# EAGLE design Matchstick (EAGLE 9.6.2)

## Sheet 1 of 2: ESP32 Pico
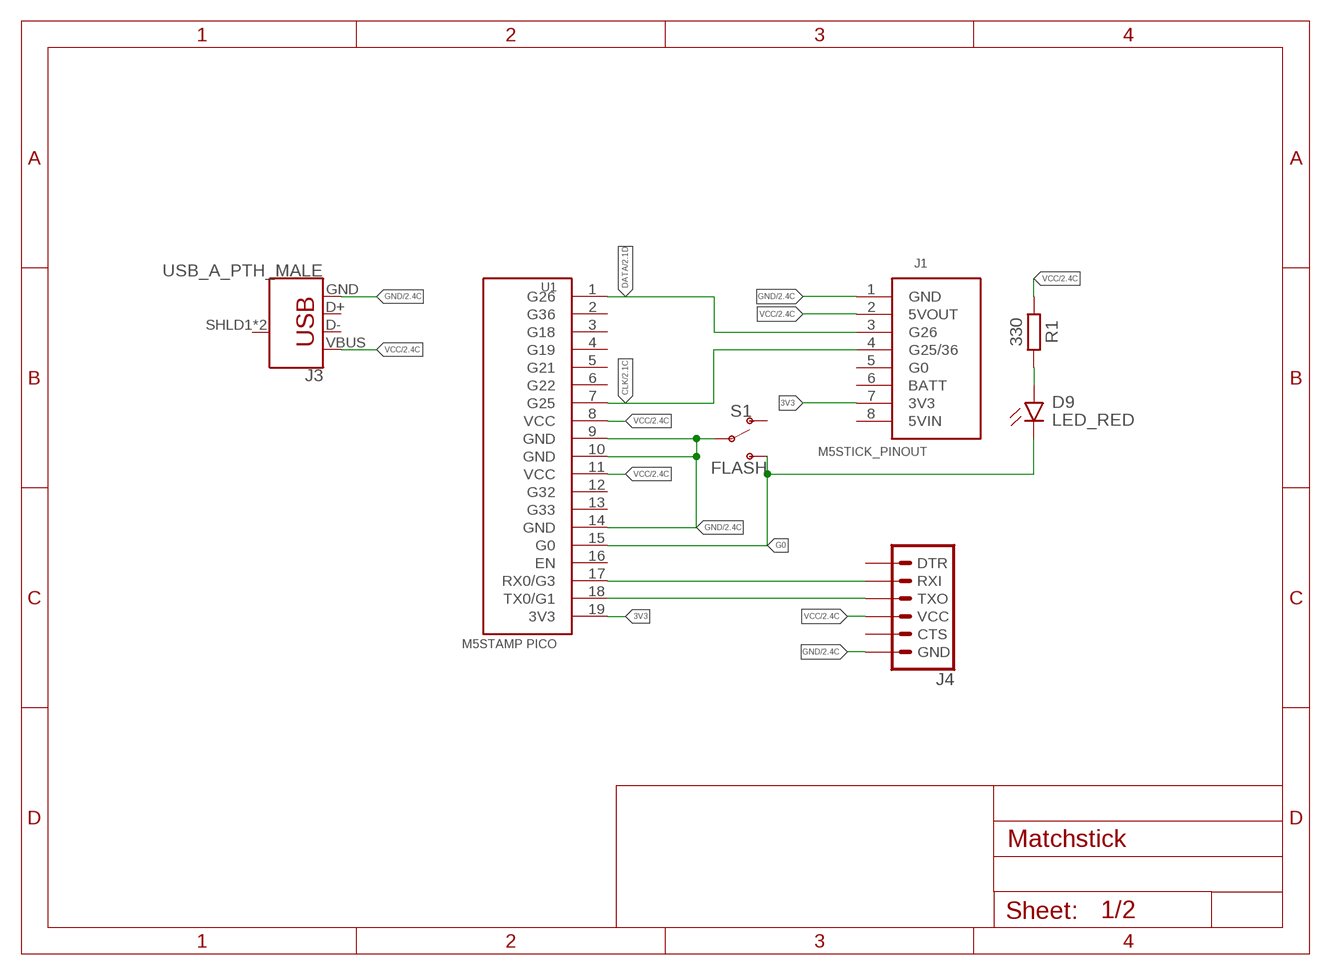
[diagram p0: schematic, sheet 1]

### Parts
D9  LED_RED  CHIP-ROUND-R_0805  [LEDC2012X105N_RND-R]
J1  M5STICK_PINOUT  [M5STICK_PINOUT]
J3  USB_A_PTH_MALE  [USB-A-H]
J4  6_PIN_SERIAL_TARGETSILK  [6_PIN_SERIAL_TARGET_SIDE_W_SILK]
R1  330  R_CHIP-0805(2012-METRIC)  [RESC2012X65]
S1  FLASH  SWITCH-SPDT-SMD-RIGHT-ANGLE  [SWITCH_SPST_SMD_A]
U1  M5STAMP PICO  M5STAMP-PICO  [M5STAMP-PICO]

### Nets
3V3: J1.7(3V3) U1.19(3V3)
CLK: J1.4(G25/36) U1.7(G25) ; also sheet 2
DATA: J1.3(G26) U1.1(G26) ; also sheet 2
G0: D9.C S1.3(S) U1.15(G0)
GND: J1.1(GND) J3.GND J4.P$6(GND) S1.2(P) U1.9(GND) U1.10(GND) U1.14(GND) ; also sheet 2
LED_PWR: D9.A R1.2
RX: J4.P$3(RXI) U1.17(RX0/G3)
TX: J4.P$2(TXO) U1.18(TX0/G1)
VCC: J1.2(5VOUT) J3.VBUS J4.P$4(VCC) R1.1 U1.8(VCC) U1.11(VCC) ; also sheet 2
Unconnected: J1.5(G0) J1.6(BATT) J1.8(5VIN) J3.D+ J3.D- J3.SHLD1(SHIELD) J3.SHLD2(SHIELD) J4.P$1(DTR) J4.P$5(CTS) S1.1(O) U1.2(G36) U1.3(G18) U1.4(G19) U1.5(G21) U1.6(G22) U1.12(G32) U1.13(G33) U1.16(EN)

## Sheet 2 of 2: LED Array
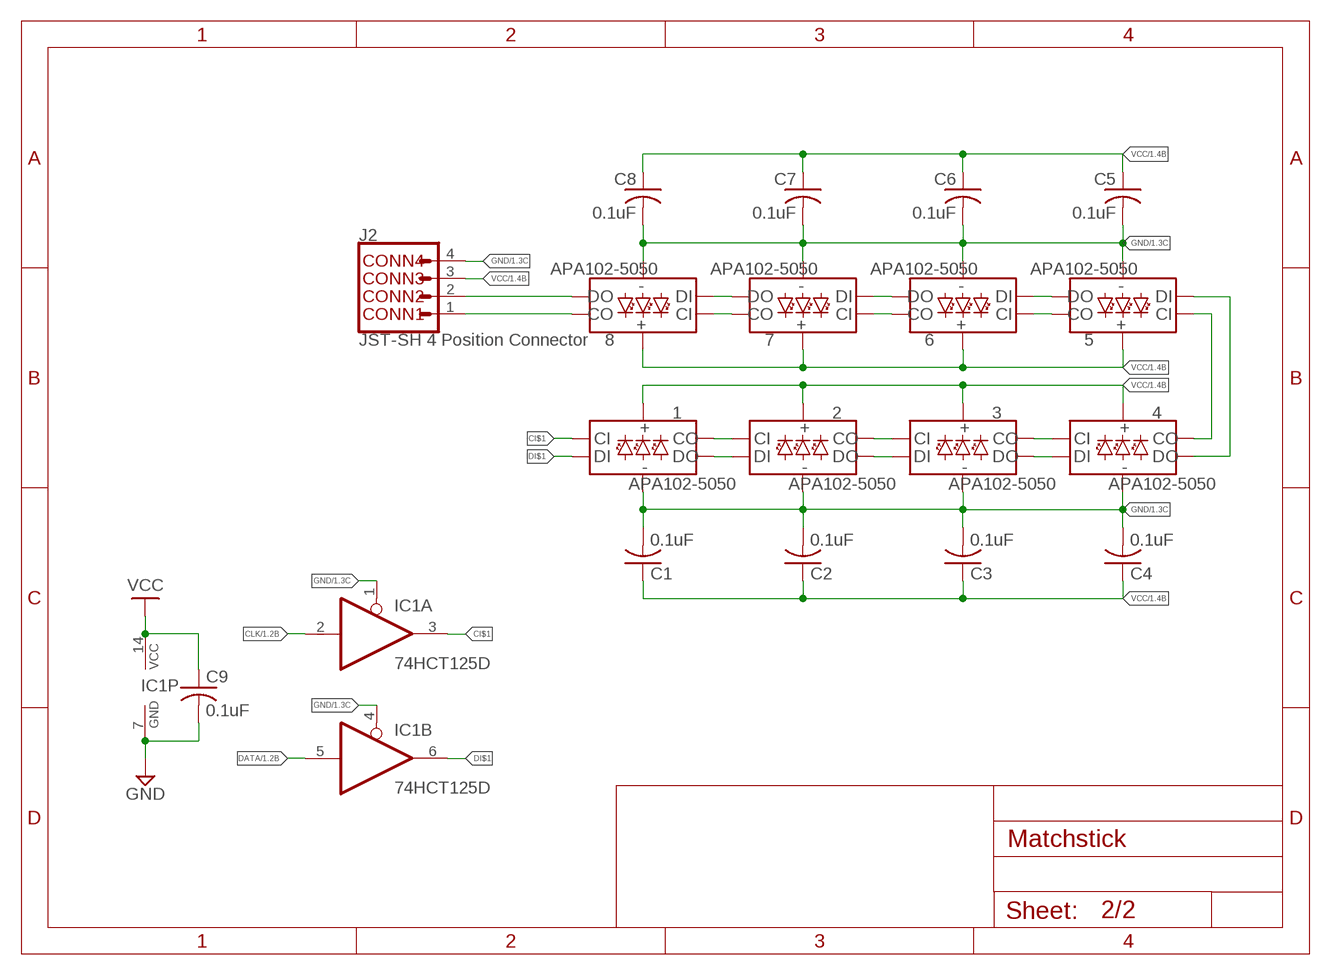
[diagram p1: schematic, sheet 2]

### Parts
1  APA102-5050  [APA102-5050]
2  APA102-5050  [APA102-5050]
3  APA102-5050  [APA102-5050]
4  APA102-5050  [APA102-5050]
5  APA102-5050  [APA102-5050]
6  APA102-5050  [APA102-5050]
7  APA102-5050  [APA102-5050]
8  APA102-5050  [APA102-5050]
C1  0.1uF  C-US_CHIP-0805(2012-METRIC)  [CAPC2012X110]
C2  0.1uF  C-US_CHIP-0805(2012-METRIC)  [CAPC2012X110]
C3  0.1uF  C-US_CHIP-0805(2012-METRIC)  [CAPC2012X110]
C4  0.1uF  C-US_CHIP-0805(2012-METRIC)  [CAPC2012X110]
C5  0.1uF  C-US_CHIP-0805(2012-METRIC)  [CAPC2012X110]
C6  0.1uF  C-US_CHIP-0805(2012-METRIC)  [CAPC2012X110]
C7  0.1uF  C-US_CHIP-0805(2012-METRIC)  [CAPC2012X110]
C8  0.1uF  C-US_CHIP-0805(2012-METRIC)  [CAPC2012X110]
C9  0.1uF  C-US_CHIP-0805(2012-METRIC)  [CAPC2012X110]
IC1  74HCT125D  [SO14]
J2  JST-SH 4 Position Connector  JST-4-SHJS-1MM  [JST04_1MM_RA]

### Nets
CI$1: 1.P2(CI) IC1.3(A:O)
CI$2: 1.P5(CO) 2.P2(CI)
CI$3: 2.P5(CO) 3.P2(CI)
CI$4: 3.P5(CO) 4.P2(CI)
CI$5: 4.P5(CO) 5.P2(CI)
CI$6: 5.P5(CO) 6.P2(CI)
CI$7: 6.P5(CO) 7.P2(CI)
CI$8: 7.P5(CO) 8.P2(CI)
CLK: IC1.2(A:I) ; also sheet 1
CO: 8.P5(CO) J2.1
DATA: IC1.5(B:I) ; also sheet 1
DI$1: 1.P1(DI) IC1.6(B:O)
DI$2: 1.P6(DO) 2.P1(DI)
DI$3: 2.P6(DO) 3.P1(DI)
DI$4: 3.P6(DO) 4.P1(DI)
DI$5: 4.P6(DO) 5.P1(DI)
DI$6: 5.P6(DO) 6.P1(DI)
DI$7: 6.P6(DO) 7.P1(DI)
DI$8: 7.P6(DO) 8.P1(DI)
DO: 8.P6(DO) J2.2
GND: 1.P3(GND) 2.P3(GND) 3.P3(GND) 4.P3(GND) 5.P3(GND) 6.P3(GND) 7.P3(GND) 8.P3(GND) C1.2 C2.2 C3.2 C4.2 C5.2 C6.2 C7.2 C8.2 C9.2 IC1.1(A:OE) IC1.4(B:OE) IC1.7(P:GND) J2.4 ; also sheet 1
VCC: 1.P4(VCC) 2.P4(VCC) 3.P4(VCC) 4.P4(VCC) 5.P4(VCC) 6.P4(VCC) 7.P4(VCC) 8.P4(VCC) C1.1 C2.1 C3.1 C4.1 C5.1 C6.1 C7.1 C8.1 C9.1 IC1.14(P:VCC) J2.3 ; also sheet 1
Unconnected: IC1.8(C:O) IC1.9(C:I) IC1.10(C:OE) IC1.11(D:O) IC1.12(D:I) IC1.13(D:OE)

## Library data of the parts
1-8 = SparkFun-LED:APA102: Addressable RGB LED - 2 Wire Common names: APA102, Dotstar, etc. Packages: 5050 2020 SparkFun Products: SparkFun Lumenati Boards <https://www.sparkfun.com/categories/405>; PROD_ID: DIO-13739
C1-C9 = Capacitor:C-US: Capacitor - ANSI; CATEGORY: Capacitor
D9 = LED:CHIP-ROUND-R: LED - Generic; CATEGORY: LED; COLOR: RED; DESCRIPTION: CHIP LED ROUND; SUB-CATEGORY: CHIP; TYPE: ROUND_TOP
IC1 = 74xx-eu:74*125: Quad bus BUFFER, 3-state
J1 = custom:M5STICK_PINOUT: M5 STICK C HEADER 8POS 2.54MM
J2 = custom:JST-4-SH: JST-SH 4 position connector An SMD 1mm pitch JST-SH connector. Compatible with SparkFun Qwiic connectors.; PROD_ID: CONN-13694
J3 = SparkFun-Connectors:USB_A: USB-A Connector Male and female variants, as well as PTH and SMT variants SparkFun Products: SparkFun XBee Explorer Dongle <https://www.sparkfun.com/products/11697> PTH Male SparkFun MicroView-USB Programmer <https://www.sparkfun.com/products/12924> SMT Male SparkFun USB Type A Female Breakout <https://www.sparkfun.com/products/12700> SMT Female; PROD_ID: CONN-08367; SF_ID: PRT-00437
J4 = SparkFun-Connectors:6_PIN_SERIAL_TARGET: 6-pin header connection for use with the "FTDI BASIC" pinout - TARGET SIDE. Also known as "Arduino Serial Program Header". It is used to mate with our FTDI Basic serial programmers using the Arduino IDE. Note, this device has "TARGET" in the name. It is intended to be used on a design that contains a target micro-controller that you wish to program. The "sister" device, named "CABLE" is inteneded to be used on a design that usually lives on the end of your USB cable and prvides the converter chip (FTDI232 or FTDI231x) to commnicate serial RX/TX. You can populate with some of these: Break Away Headers - Straight <https://www.sparkfun.com/products/116> (PRT-00116) For reference (or to suit your programming needs) check out these designs: SparkFun FTDI Basic Breakout - 5V <https://www.sparkfun.com/products/9716> (DEV-09716) SparkFun FTDI Basic Breakout - 3.3V <https://www.sparkfun.com/products/9873> (DEV-09873) SparkFun FTDI SmartBasic <https://www.sparkfun.com/products/12935> (DEV-12935) SparkFun Beefy 3 - FTDI Basic Breakout <https://www.sparkfun.com/products/13746> (DEV-13746)
R1 = Resistor:R: Resistor Fixed - Generic; CATEGORY: Resistor; SUB-CATEGORY: Fixed
S1 = SparkFun-Switches:SWITCH-SPDT: Single Pole, Double Throw (SPDT) Switch Single-pole, double-throw (SPDT) switch. Variant Overview SMD-AYZ0202 Surface Mount DPDT Switch <https://www.sparkfun.com/products/597> (COM-00597) Used on e.g. LilyPad Arduino USB - ATmega32U4 Board <https://www.sparkfun.com/products/12049> PTH-11.6X4.0MM SPDT Mini Power Switch <https://www.sparkfun.com/products/102> (COM-00102) Used on e.g. SparkFun Simon Says - Through-Hole Soldering Kit <https://www.sparkfun.com/products/10547> (KIT-10547) PTH-11.6X4.0MM-KIT KIT version of SPDT Mini Power Switch - Simplifies soldering by removing tStop of switch pins - only one side can be soldered. PTH-11.6X4.0MM-LOCK LOCK version of SPDT Mini Power Switch - Offset pins hold switch in place for easier soldering. SMD-RIGHT-ANGLE Surface Mount Right Angle Switch <https://www.sparkfun.com/products/10860> (COM-10860) Used on e.g. SparkFun ESP8266 Thing <https://www.sparkfun.com/products/13231>; PROD_ID: SWCH-10651; SF_SKU: COM-10860
U1 = custom:M5STAMP-PICO: M5 Stamp Pico <https://docs.m5stack.com/en/core/stamp_pico>

## Board
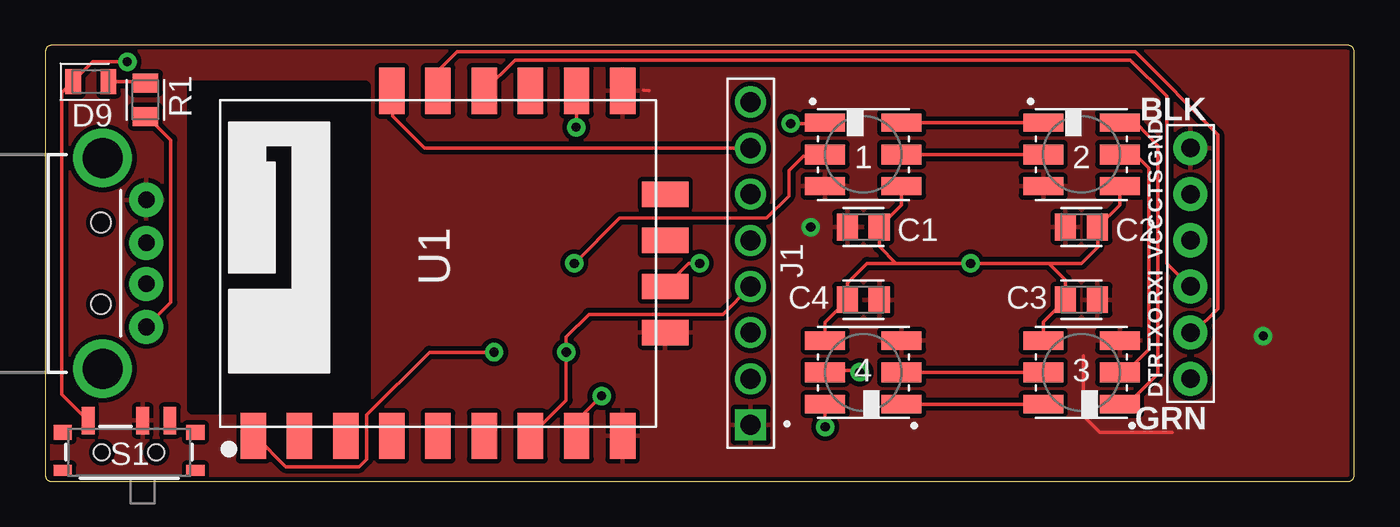
[diagram p2: board, top side]
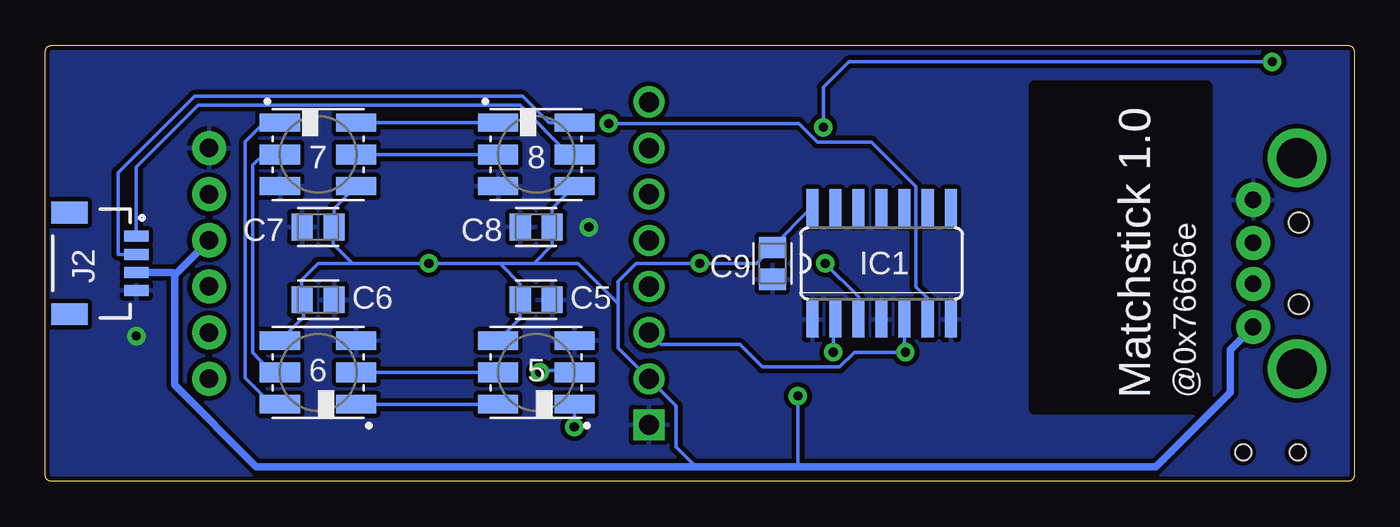
[diagram p3: board, bottom side, seen from below]

Size 72 x 24 mm. Coordinates in mm from the lower left corner, seen from the top.
Outline: 0.32,0 71.68,0 arc90 72,0.32 72,23.68 arc90 71.68,24 0.32,24 arc90 0,23.68 0,0.32 arc90 0.32,0
Copper layers (1*16): Top 0.035mm / dielectric 1.5mm / Bottom 0.035mm
Design rules "SparkFun *": minimum track width 8mil, minimum drill 20mil, track to track 8mil, track to pad 8mil, pad to pad 8mil, via to via 8mil, smd to smd 8mil, copper to edge 10mil, drill to drill 8mil, minimum pad ring 12mil, minimum via ring 10mil, stop-mask expansion 4mil, vias tented up to drill 20mil, thermal gap 10mil
bRestrict: area 25.3,7.5 to 28,7.7

### Footprints (pad centres in the part's own frame; a part is rotated, then mirrored left to right if it is on the bottom)
APA102-5050 = smd 1 x 2.2: P1 -1.75,-2.1; P3 1.75,-2.1; P4 1.75,2.1; P6 -1.75,2.1 | smd 1.1 x 2.2: P2 0,-2.1; P5 0,2.1
CAPC2012X110 = smd 1.165 x 1.465: 1 -0.875,0; 2 0.875,0
LEDC2012X105N_RND-R = smd 0.862 x 1.362: A 0.975,0; C -0.975,0
SO14 = smd 0.66 x 2.032: 1 -3.81,-3.073; 2 -2.54,-3.073; 3 -1.27,-3.073; 4 0,-3.073; 5 1.27,-3.073; 6 2.54,-3.073; 7 3.81,-3.073; 8 3.81,3.073; 9 2.54,3.073; 10 1.27,3.073; 11 0,3.073; 12 -1.27,3.073; 13 -2.54,3.073; 14 -3.81,3.073
M5STICK_PINOUT = drill 1.1 square: 1 -8.89,0 | drill 1.1: 2 -6.35,0; 3 -3.81,0; 4 -1.27,0; 5 1.27,0; 6 3.81,0; 7 6.35,0; 8 8.89,0
JST04_1MM_RA = smd 0.6 x 1.35: 1 -1.5,0; 2 -0.5,0; 3 0.5,0; 4 1.5,0 | smd 1.2 x 2: NC1 2.8,-3.675; NC2 -2.8,-3.675
USB-A-H = drill 0.914 pad 1.88: D+ 2.4,1.127; D- 2.4,-1.127; GND 2.4,3.5; VBUS 2.4,-3.5 | drill 2.2: SHLD1 0,-5.8; SHLD2 0,5.8 | hole 1.1: -0.1,2.25; -0.1,-2.25
6_PIN_SERIAL_TARGET_SIDE_W_SILK = drill 1.016 pad 1.88: P$1 -6.35,0; P$2 -3.81,0; P$3 -1.27,0; P$4 1.27,0; P$5 3.81,0; P$6 6.35,0
RESC2012X65 = smd 1.031 x 1.42: 1 -0.919,0; 2 0.919,0
SWITCH_SPST_SMD_A = smd 0.7 x 1.5: 1 -2.25,-1.75; 2 -0.75,-1.75; 3 2.25,-1.75 | smd 1 x 0.6: GND1 -3.65,1; GND3 3.65,1 | smd 1 x 0.8: GND2 -3.65,-1.1; GND4 3.65,-1.1 | hole 0.9: -1.5,0; 1.5,0
M5STAMP-PICO = smd 2.54 x 1.4: 1 -9.5,10.16; 2 -9.5,7.62; 3 -9.5,5.08; 4 -9.5,2.54; 5 -9.5,0; 6 -9.5,-2.54; 7 -9.5,-5.08; 8 -9.5,-7.62; 9 -9.5,-10.16; 14 9.5,-10.16; 15 9.5,-7.62; 16 9.5,-5.08; 17 9.5,-2.54; 18 9.5,0; 19 9.5,2.54 | smd 1.4 x 2.54: 10 -3.81,-12.5; 11 -1.27,-12.5; 12 1.27,-12.5; 13 3.81,-12.5

### Placement (x,y rotation side)
1  45,18 270 top
2  57,18 270 top
3  57,6 90 top
4  45,6 90 top
5  45,6 90 bottom
6  57,6 90 bottom
7  57,18 270 bottom
8  45,18 270 bottom
C1  45,14 180 top
C2  57,14 180 top
C3  57,10 0 top
C4  45,10 0 top
C5  45,10 0 bottom
C6  57,10 0 bottom
C7  57,14 180 bottom
C8  45,14 180 bottom
C9  32,12 270 bottom
D9  2.5,22 0 top
IC1  26,12 0 bottom
J1  38.8,12 90 top
J2  67,12 270 bottom
J3  3.15,12 0 top
J4  63,12 90 top
R1  5.5,21 90 top
S1  4.6,1.6 180 top
U1  21.6,12 90 top

### Tracks (layer width: path | path; a pad name or v marks a point on that pad's centre or on a via)
3V3
  Top 0.203: U1.19 19.1,21.34 19.1,20.12 20.87,18.35 J1.7
CI$1  (via drill 0.51)
  Top 0.203: v29.1,12 31.59,14.49 39.68,14.49 40.9,15.71 40.9,17.1 41.7,17.9 42.8,17.9 1.P2
  Bottom 0.203: IC1.3 27.27,10.17 v29.1,12
CI$2
  Top 0.203: 1.P5 2.P2
CI$3
  Top 0.203: 2.P5 59.96,18 60.7,17.26 60.7,7.25 59.45,6 3.P2
CI$4
  Top 0.203: 3.P5 4.P2
CI$5  (via drill 0.51)
  Top 0.203: v44.8,6 44.7,6.1 43.08,6.1 5.P2
  Bottom 0.203: 5.P2 43.08,6.1 44.7,6.1 v44.8,6
CI$6
  Bottom 0.203: 6.P2 5.P5
CI$7
  Bottom 0.203: 7.P2 60,18 60.6,17.4 60.6,7.11 59.48,5.89 59.13,5.89 59.13,5.97 6.P5
CI$8
  Bottom 0.203: 7.P5 8.P2
CLK  (via drill 0.51)
  Top 0.203: U1.7 26.82,2.64 28.65,4.47 v28.65,7.11 28.65,7.95 29.9,9.2 33.4,9.2 | J1.4 37.27,9.2 33.4,9.2 | 33.4,9.2
  Bottom 0.203: v28.65,7.11 28.65,8.74 IC1.2
CO
  Bottom 0.203: 8.P5 43.18,18 45.88,20.7 63.6,20.7 67,17.3 J2.1
DATA  (via drill 0.51)
  Top 0.203: v24.68,7.11 21.13,7.11 17.68,3.66 17.68,1.22 17.27,0.81 13.21,0.81 11.58,2.44 U1.1
  Bottom 0.203: J1.3 38.14,7.53 33.8,7.53 32.56,6.3 28.32,6.3 27.5,7.11 v24.68,7.11 24.73,7.16 IC1.5
DI$1  (via drill 0.51)
  Top 0.203: 1.P1 42.85,19.7 v41,19.7
  Bottom 0.203: IC1.6 23.46,10.06 24.1,10.7 24.1,13.93 24.09,13.93 24.09,16.22 26.57,18.69 29.54,18.69 30.55,19.7 v41,19.7
DI$2
  Top 0.203: 1.P6 2.P1
DI$3
  Top 0.203: 2.P6 59.13,19.71 60.02,19.71 61.2,18.48 61.2,5.93 59.52,4.25 3.P1
DI$4
  Top 0.203: 3.P6 4.P1
DI$5  (via drill 0.51)
  Top 0.203: v42.9,3 42.88,3.05 42.88,4.06 4.P6
  Bottom 0.203: 4.P6 42.88,4.06 42.88,3.05 v42.9,3
DI$6
  Bottom 0.203: 6.P1 5.P6
DI$7
  Bottom 0.203: 7.P1 59.25,19.6 60.1,19.6 61.01,18.69 61.01,5.71 59.55,4.25 6.P6
DI$8
  Bottom 0.203: 7.P6 8.P1
DO
  Bottom 0.203: 8.P6 44.3,19.75 45.75,21.2 63.8,21.2 68,17 68,12.5 J2.2
G0  (via drill 0.51)
  Top 0.203: U1.15 29.22,19.52 v29.2,19.5 | v4.5,23.1 2.6,23.1 1.52,22.02 | 1.52,22.02 D9.C | 1.52,22.02 0.9,21.4 0.9,4.79 1.79,3.9 1.8,3.9 S1.3
  Bottom 0.203: v29.2,19.5 29.2,21.7 27.8,23.1 v4.5,23.1
GND  (via drill 0.51)
  Top 0.203: C4.2 45.92,9.96 46.24,9.96 | C1.2 44.09,14.02 43.78,14.02 | U1.10 34.14,8.13 34.1,8.09 | 31.9,21.54 U1.14 | 32.92,21.54 33.2,21.5 | 55.8,14 C2.2 | 58.3,10 C3.2 | 62,2.7 58,2.7 57.1,3.6 57.1,6.9
  other vias: 42.1,14 67,8
  pour Bottom (isolate 0.254): 72,0.32 72,23.68 arc90 71.68,24 0.32,24 arc90 0,23.68 0,0.32 arc90 0.32,0 71.68,0 arc90
  pour Top (isolate 0.254): 71.68,24 0.32,24 arc90 0,23.68 0,0.32 arc90 0.32,0 71.68,0 arc90 72,0.32 72,23.68 arc90
LED_PWR
  Top 0.203: D9.A 5.42,22 R1.2
RX
  Top 0.203: U1.17 25.84,23.2 59.7,23.2 61.7,21.2 61.7,12 62.97,10.73 J4.P$3
TX
  Top 0.203: U1.18 21.6,22.6 22.64,23.64 59.96,23.64 64.5,19.1 64.5,9.5 63.19,8.19 J4.P$2
VCC  (via drill 0.51)
  Top 0.203: R1.1 5.5,20.2 6.9,18.8 6.9,9.85 J3.VBUS | 4.P4 42.88,7.72 42.88,8.75 C4.1 44.12,10.93 45.2,12 46.8,12 | U1.8 29.22,3.32 v30.6,4.7 | 55.2,12 57,12 57.9,12.9 57.9,13.97 C2.1 59.1,15.22 2.P4 | 55.2,12 v50.9,12 46.8,12 | 55.2,12 56.12,11.07 C3.1 54.9,8.78 3.P4 | 46.8,12 45.88,12.93 C1.1 47.1,15.22 1.P4 | U1.11 35.37,12 v36,12
  Bottom 0.203: IC1.14 29.87,15.04 32,12.91 C9.1 32.88,12 v36,12 39.5,12 40.5,11 40.5,9.8 | 6.P4 57.79,9.06 57.79,9.91 C6.1 57.9,10.03 57.9,11.1 57,12 55.1,12 | 7.P4 56.12,15.03 C7.1 56.16,13.96 56.16,13.06 55.1,12 | 8.P4 44.12,15.03 C8.1 44.12,13 45.12,12 | 5.P4 45.88,8.97 C5.1 45.88,10.88 47,12 | v30.6,4.7 30.6,0.8 | 40.5,9.8 40.5,7.35 J1.2 37.3,4.15 37.3,1.9 36.2,0.8 | 40.5,9.8 42.7,12 45.12,12 | 55.1,12 v50.9,12 47,12 | 47,12 45.12,12 | 64.9,11.37 65.03,11.5
  Bottom 0.406: J3.VBUS 6.81,7.24 6.81,4.89 10.91,0.8 30.6,0.8 36.2,0.8 60.4,0.8 64.9,5.3 64.9,11.37 J4.P$4 | 65.03,11.5 J2.3

### Text on the board
bPlace: @0x76656e | Matchstick 1.0